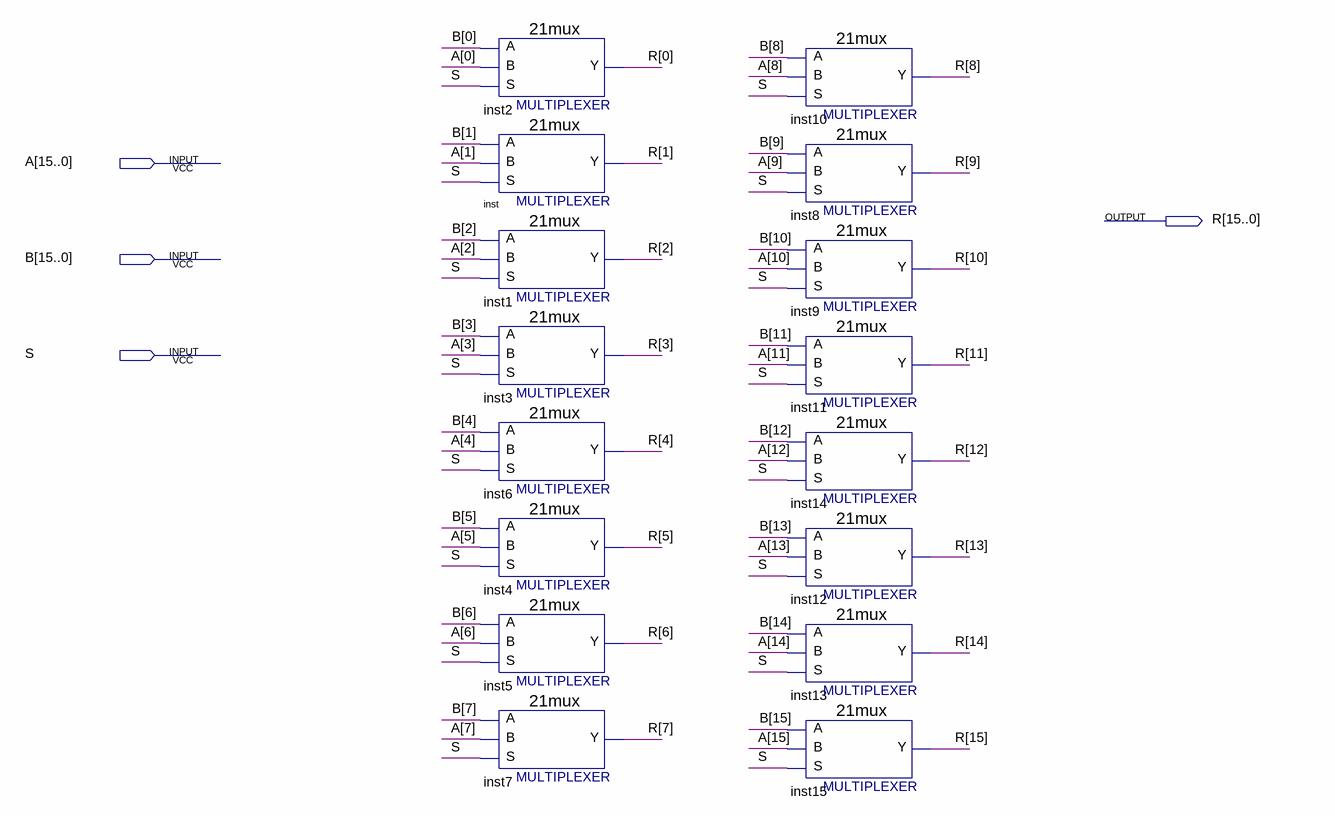
[diagram p0: schematic sheet]
// Quartus schematic mux21_16bit.bdf as structural Verilog: 16 symbols, 4 pins
module mux21_16bit (
  input  [15:0] A,
  input  [15:0] B,
  input  S,
  output [15:0] R
);

  \21mux  inst2 (.S(S), .B(A[0]), .A(B[0]), .Y(R[0]));
  \21mux  inst (.S(S), .B(A[1]), .A(B[1]), .Y(R[1]));
  \21mux  inst1 (.S(S), .B(A[2]), .A(B[2]), .Y(R[2]));
  \21mux  inst3 (.S(S), .B(A[3]), .A(B[3]), .Y(R[3]));
  \21mux  inst6 (.S(S), .B(A[4]), .A(B[4]), .Y(R[4]));
  \21mux  inst4 (.S(S), .B(A[5]), .A(B[5]), .Y(R[5]));
  \21mux  inst5 (.S(S), .B(A[6]), .A(B[6]), .Y(R[6]));
  \21mux  inst7 (.S(S), .B(A[7]), .A(B[7]), .Y(R[7]));
  \21mux  inst10 (.S(S), .B(A[8]), .A(B[8]), .Y(R[8]));
  \21mux  inst8 (.S(S), .B(A[9]), .A(B[9]), .Y(R[9]));
  \21mux  inst9 (.S(S), .B(A[10]), .A(B[10]), .Y(R[10]));
  \21mux  inst11 (.S(S), .B(A[11]), .A(B[11]), .Y(R[11]));
  \21mux  inst14 (.S(S), .B(A[12]), .A(B[12]), .Y(R[12]));
  \21mux  inst12 (.S(S), .B(A[13]), .A(B[13]), .Y(R[13]));
  \21mux  inst13 (.S(S), .B(A[14]), .A(B[14]), .Y(R[14]));
  \21mux  inst15 (.S(S), .B(A[15]), .A(B[15]), .Y(R[15]));
endmodule
